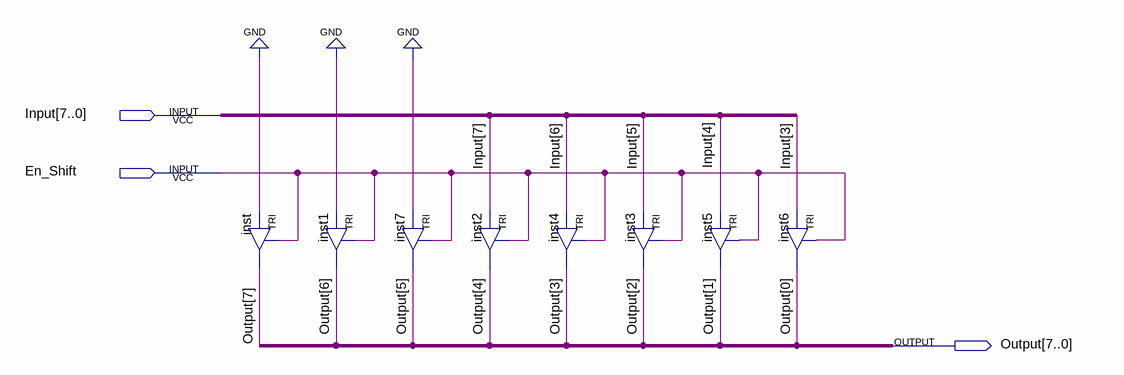
[diagram p0: schematic sheet]
// Quartus schematic Shift_3.bdf as structural Verilog: 8 symbols, 3 pins
module Shift_3 (
  input  [7:0] Input,
  input  En_Shift,
  output [7:0] Output
);

  TRI inst (.IN(1'b0), .OE(En_Shift), .OUT(Output[7]));
  TRI inst1 (.IN(1'b0), .OE(En_Shift), .OUT(Output[6]));
  TRI inst7 (.IN(1'b0), .OE(En_Shift), .OUT(Output[5]));
  TRI inst2 (.IN(Input[7]), .OE(En_Shift), .OUT(Output[4]));
  TRI inst4 (.IN(Input[6]), .OE(En_Shift), .OUT(Output[3]));
  TRI inst3 (.IN(Input[5]), .OE(En_Shift), .OUT(Output[2]));
  TRI inst5 (.IN(Input[4]), .OE(En_Shift), .OUT(Output[1]));
  TRI inst6 (.IN(Input[3]), .OE(En_Shift), .OUT(Output[0]));
endmodule
